# EAGLE schematic Dual linear VCA chip v2.0 (EAGLE 6.2)
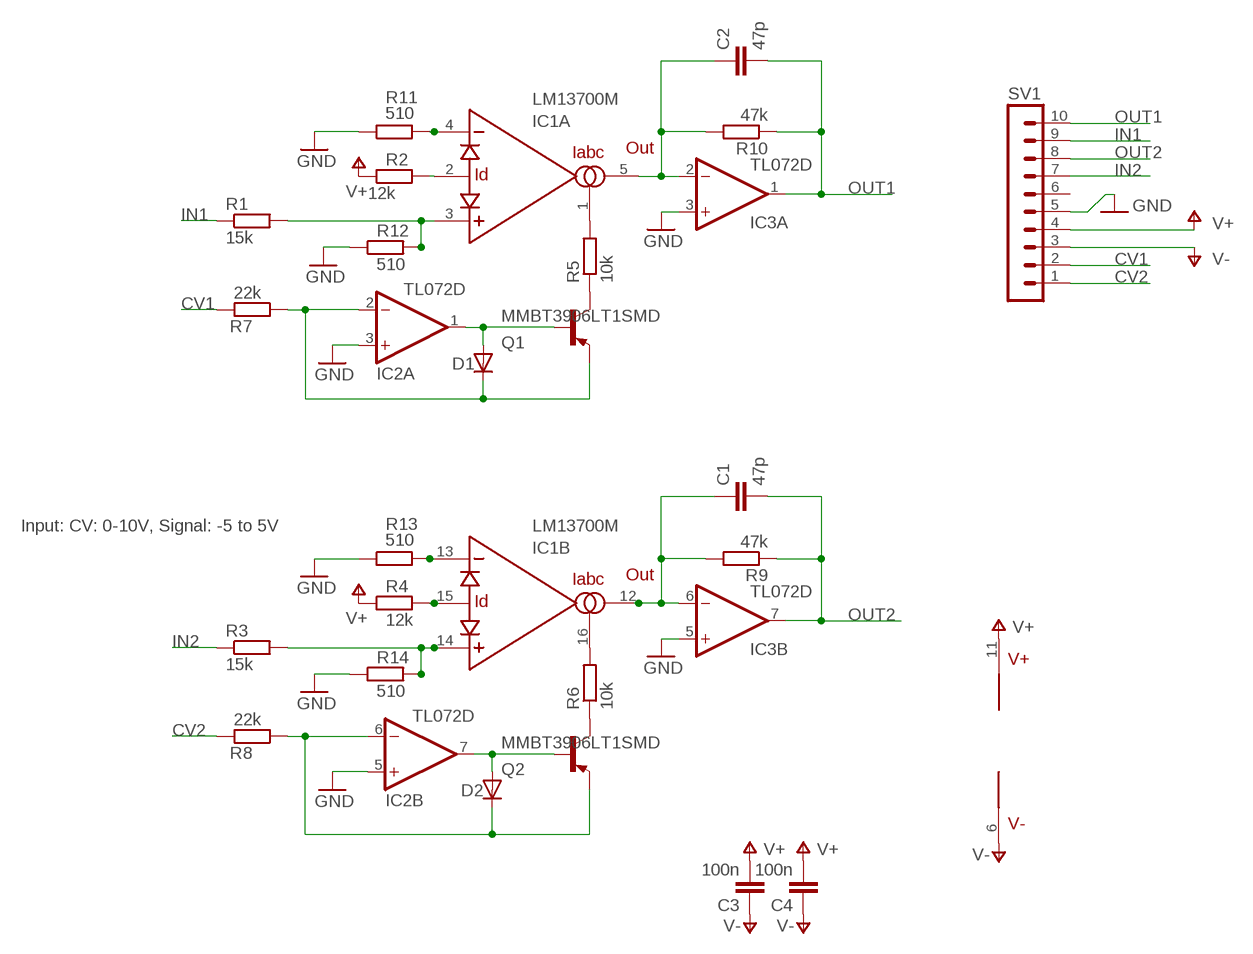
[diagram p0: schematic, sheet 1]

## Parts
C1  47p  C-EUC0805  [C0805]
C2  47p  C-EUC0805  [C0805]
C3  100n  C-EUC0805  [C0805]
C4  100n  C-EUC0805  [C0805]
D1  DIODE-SOD80C  [SOD80C]
D2  DIODE-SOD80C  [SOD80C]
IC1  LM13700M  [SO16]
IC2  TL072D  [SO08]
IC3  TL072D  [SO08]
Q1  MMBT3906LT1SMD  [SOT23-BEC]
Q2  MMBT3906LT1SMD  [SOT23-BEC]
R1  15k  R-EU_R0805  [R0805]
R2  12k  R-EU_R0805  [R0805]
R3  15k  R-EU_R0805  [R0805]
R4  12k  R-EU_R0805  [R0805]
R5  10k  R-EU_R0805  [R0805]
R6  10k  R-EU_R0805  [R0805]
R7  22k  R-EU_R0805  [R0805]
R8  22k  R-EU_R0805  [R0805]
R9  47k  R-EU_R0805  [R0805]
R10  47k  R-EU_R0805  [R0805]
R11  510  R-EU_R0805  [R0805]
R12  510  R-EU_R0805  [R0805]
R13  510  R-EU_R0805  [R0805]
R14  510  R-EU_R0805  [R0805]
SV1  MA10-1  [MA10-1]

## Nets
CV1: R7.2 SV1.2
CV2: R8.2 SV1.1
GND: IC2.3(A:+IN) IC2.5(B:+IN) IC3.3(A:+IN) IC3.5(B:+IN) R11.1 R12.1 R13.1 R14.1 SV1.5
IN1: R1.1 SV1.9
IN2: R3.1 SV1.7
N$1: Q1.C R5.1
N$2: Q2.C R6.1
N$3: D1.C IC2.2(A:-IN) Q1.E R7.1
N$4: IC1.1(A:IABC) R5.2
N$6: IC1.2(A:ID) R2.2
N$8: D2.A IC2.7(B:OUT) Q2.B
N$9: C2.1 IC1.5(A:OUT) IC3.2(A:-IN) R10.2
N$10: D1.A IC2.1(A:OUT) Q1.B
N$11: D2.C IC2.6(B:-IN) Q2.E R8.1
N$14: IC1.16(B:IABC) R6.2
N$17: IC1.15(B:ID) R4.2
N$21: C1.1 IC1.12(B:OUT) IC3.6(B:-IN) R9.2
OUT1: C2.2 IC3.1(A:OUT) R10.1 SV1.10
OUT2: C1.2 IC3.7(B:OUT) R9.1 SV1.8
TRIM1+: IC1.3(A:+IN) R1.2 R12.2
TRIM1-: IC1.4(A:-IN) R11.2
TRIM2+: IC1.14(B:+IN) R3.2 R14.2
TRIM2-: IC1.13(B:-IN) R13.2
V+: C3.2 C4.2 IC1.11(V+) R2.1 R4.1 SV1.4
V-: C3.1 C4.1 IC1.6(V-) SV1.3
Unconnected: IC1.7(IN) IC1.8(OUT) IC1.9(OUT) IC1.10(IN) SV1.6

## Notes on the sheet
- Input: CV: 0-10V, Signal: -5 to 5V

## Power pins joined to a net without a drawn wire
V+: IC2.8(P:V+) IC3.8(P:V+)
V-: IC2.4(P:V-) IC3.4(P:V-)

## Library data of the parts
C1-C4 = resistor:C-EU: CAPACITOR, European symbol
D1 D2 = diode:DIODE-: DIODE
IC1 = synthdiy:LM13700: National Dual OTA with buffers.
IC2 IC3 = linear:TL072: OP AMP
Q1 Q2 = transistor-pnp:MMBT3906*: PNP Transistror
R1-R14 = resistor:R-EU_: RESISTOR, European symbol
SV1 = con-lstb:MA10-1: PIN HEADER; OC_FARNELL: unknown; OC_NEWARK: unknown